# Altium schematic sheet [02] - POWER.SchDoc
size A2; SheetNumber: 5; SheetTotal: 5
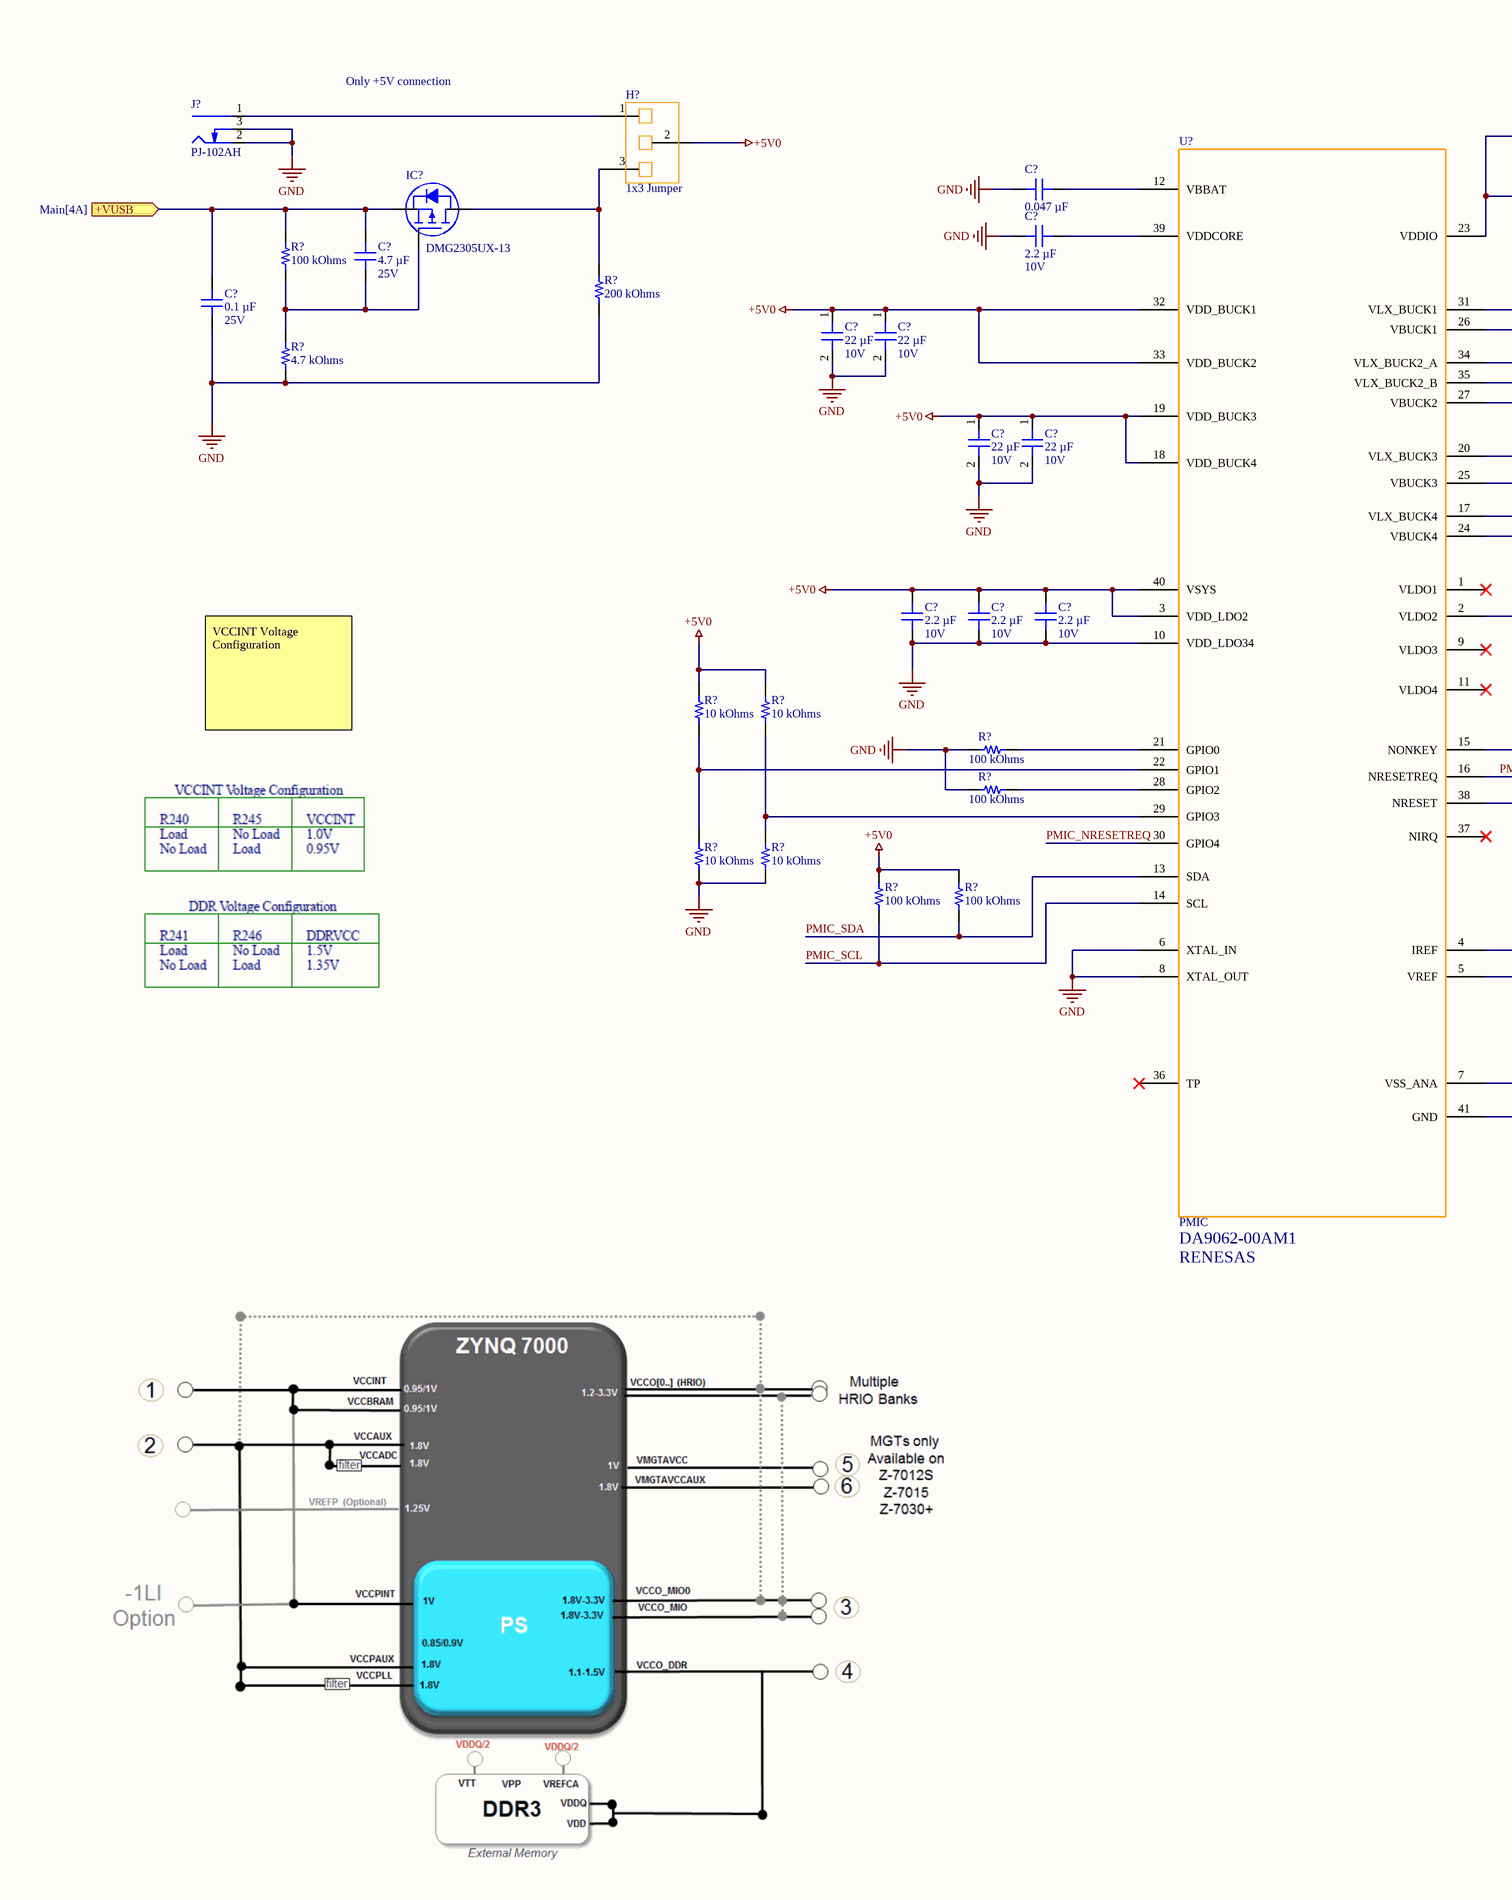
[diagram p0: [02] - POWER.SchDoc, left]
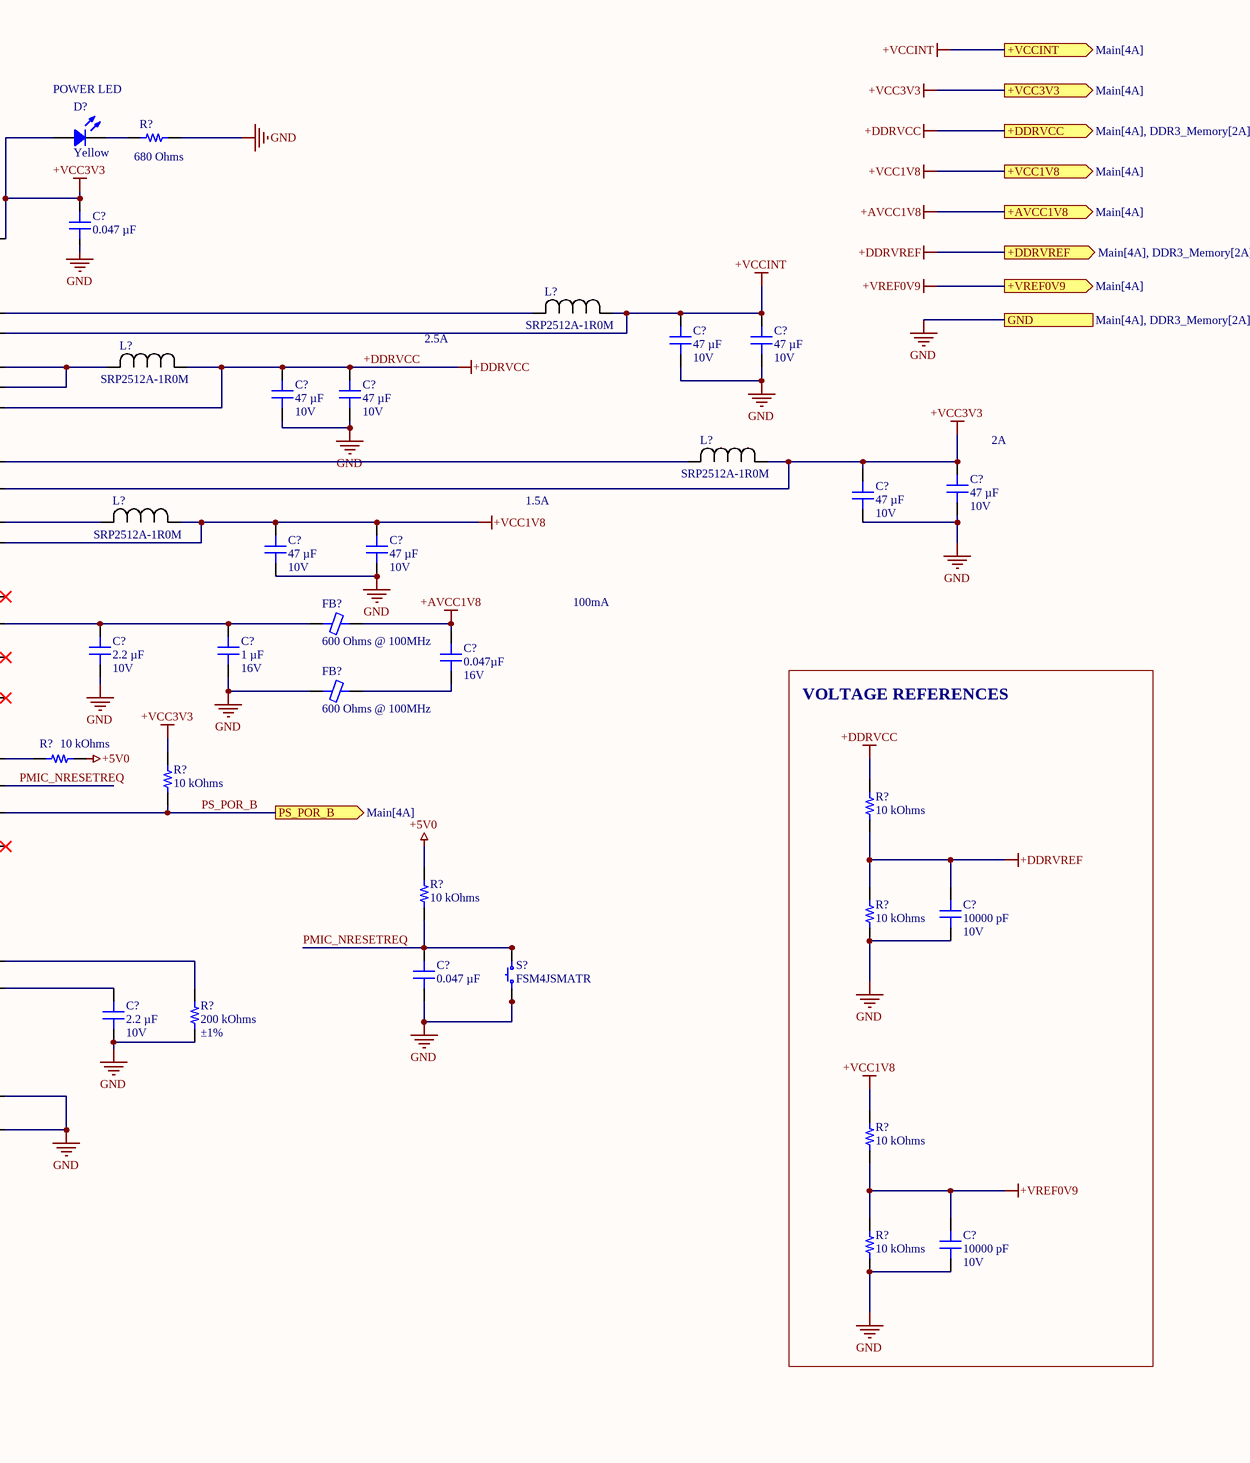
[diagram p1: [02] - POWER.SchDoc, right]

## Parts
(Parts that share a designator on the sheet are numbered #1, #2 ... from top to bottom, then left to right.)
C?#1  0.047 µF  [CAP 0402_1005]
C?#2  0.047 µF  [CAP 0402_1005]
C?#3  Voltage - Rated: 10V  [CAP 0603_1608]  (hidden comment: 2.2 µF)
C?#4  Voltage - Rated: 25V  [CAP 0603_1608]  (hidden comment: 4.7 µF)
C?#5  Voltage - Rated: 25V  [CAP 0402_1005]  (hidden comment: 0.1 µF)
C?#6  Voltage - Rated: 10V  [CAP 0805_2012]  (hidden comment: 22 µF)
C?#7  Voltage - Rated: 10V  [CAP 0805_2012]  (hidden comment: 22 µF)
C?#8  Voltage - Rated: 10V  [CAP 0805_2012]  (hidden comment: 47 µF)
C?#9  Voltage - Rated: 10V  [CAP 0805_2012]  (hidden comment: 47 µF)
C?#10  Voltage - Rated: 10V  [CAP 0805_2012]  (hidden comment: 47 µF)
C?#11  Voltage - Rated: 10V  [CAP 0805_2012]  (hidden comment: 47 µF)
C?#12  Voltage - Rated: 10V  [CAP 0805_2012]  (hidden comment: 22 µF)
C?#13  Voltage - Rated: 10V  [CAP 0805_2012]  (hidden comment: 22 µF)
C?#14  Voltage - Rated: 10V  [CAP 0805_2012]  (hidden comment: 47 µF)
C?#15  Voltage - Rated: 10V  [CAP 0805_2012]  (hidden comment: 47 µF)
C?#16  Voltage - Rated: 10V  [CAP 0805_2012]  (hidden comment: 47 µF)
C?#17  Voltage - Rated: 10V  [CAP 0805_2012]  (hidden comment: 47 µF)
C?#18  Voltage - Rated: 10V  [CAP 0603_1608]  (hidden comment: 2.2 µF)
C?#19  Voltage - Rated: 10V  [CAP 0603_1608]  (hidden comment: 2.2 µF)
C?#20  Voltage - Rated: 10V  [CAP 0603_1608]  (hidden comment: 2.2 µF)
C?#21  Voltage - Rated: 10V  [CAP 0603_1608]  (hidden comment: 2.2 µF)
C?#22  Voltage - Rated: 16V  [CAP 0402_1005]  (hidden comment: 1 µF)
C?#23  Voltage - Rated: 16V  [CAP 0402_1005]  (hidden comment: 0.047µF)
C?#24  Voltage - Rated: 10V  [CAP 0201_0603]  (hidden comment: 10000 pF)
C?#25  0.047 µF  [CAP 0402_1005]
C?#26  Voltage - Rated: 10V  [CAP 0603_1608]  (hidden comment: 2.2 µF)
C?#27  Voltage - Rated: 10V  [CAP 0201_0603]  (hidden comment: 10000 pF)
D?  Yellow  [LED 1206_3216 YELLOW]
FB?#1  600 Ohms @ 100MHz  [FER 0603_1608]
FB?#2  600 Ohms @ 100MHz  [FER 0603_1608]
H?  1x3 Jumper  [1x3 Header]
IC?  DMG2305UX-13  [DIODES SOT-23-3]
J?  PJ-102AH  [CUI PJ-102AH]
L?#1  Manufacturer Part Number: SRP2512A-1R0M  [SRP2512A]  (hidden comment: Inductor)
L?#2  Manufacturer Part Number: SRP2512A-1R0M  [SRP2512A]  (hidden comment: Inductor)
L?#3  Manufacturer Part Number: SRP2512A-1R0M  [SRP2512A]  (hidden comment: Inductor)
L?#4  Manufacturer Part Number: SRP2512A-1R0M  [SRP2512A]  (hidden comment: Inductor)
R?#1  680 Ohms  [RES 0402_1005]
R?#2  100 kOhms  [RES 0402_1005]
R?#3  200 kOhms  [RES 0402_1005]
R?#4  4.7 kOhms  [RES 0402_1005]
R?#5  10 kOhms  [RES 0402_1005]
R?#6  10 kOhms  [RES 0402_1005]
R?#7  100 kOhms  [RES 0402_1005]
R?#8  10 kOhms  [RES 0402_1005]
R?#9  10 kOhms  [RES 0402_1005]
R?#10  100 kOhms  [RES 0402_1005]
R?#11  10 kOhms  [RES 0402_1005]
R?#12  10 kOhms  [RES 0402_1005]
R?#13  10 kOhms  [RES 0402_1005]
R?#14  10 kOhms  [RES 0402_1005]
R?#15  100 kOhms  [RES 0402_1005]
R?#16  100 kOhms  [RES 0402_1005]
R?#17  10 kOhms  [RES 0402_1005]
R?#18  Tolerance: ±1%  [RES 0402_1005]  (hidden comment: 200 kOhms)
R?#19  10 kOhms  [RES 0402_1005]
R?#20  10 kOhms  [RES 0402_1005]
S?  FSM4JSMATR  [TE FSM4JSMA]
U?  PMIC  Manufacturer Part Number: DA9062-00AM1  Manufacturer: RENESAS  [DA9062]

## Blocks framed on the sheet
VOLTAGE REFERENCES: C?#24 C?#27 R?#11 R?#17 R?#19 R?#20

## Ports
+AVCC1V8 (out, see Main[4A]), +DDRVCC (out, see Main[4A], DDR3_Memory[2A]), +DDRVREF (out, see Main[4A], DDR3_Memory[2A]), +VCC1V8 (out, see Main[4A]), +VCC3V3 (out, see Main[4A]), +VCCINT (out, see Main[4A]), +VREF0V9 (out, see Main[4A]), +VUSB (in, see Main[4A]), GND (see Main[4A], DDR3_Memory[2A], FPGA_Power[1A]), PS_POR_B (out, see Main[4A])

## Nets
+5V0: C?#6.1 C?#7.1 C?#12.1 C?#13.1 C?#18.2 C?#19.2 C?#20.2 H?.2 R?#5.2 R?#6.2 R?#8.1 R?#14.2 R?#15.1 R?#16.2 U?.3(VDD_LDO2) U?.18(VDD_BUCK4) U?.19(VDD_BUCK3) U?.32(VDD_BUCK1) U?.33(VDD_BUCK2) U?.40(VSYS)
+AVCC1V8: C?#23.2 FB?#1.2 ; port +AVCC1V8
+DDRVCC: C?#10.2 C?#11.2 L?#2.1 R?#11.2 U?.27(VBUCK2) ; port +DDRVCC
+DDRVREF: C?#24.2 R?#11.1 R?#17.2 ; port +DDRVREF
+VCC1V8: C?#16.2 C?#17.2 L?#4.1 R?#19.2 U?.24(VBUCK4) ; port +VCC1V8
+VCC3V3: C?#2.2 C?#14.2 C?#15.2 D?.1 L?#3.1 R?#9.2 U?.23(VDDIO) U?.25(VBUCK3) ; port +VCC3V3
+VCCINT: C?#8.2 C?#9.2 L?#1.1 U?.26(VBUCK1) ; port +VCCINT
+VREF0V9: C?#27.2 R?#19.1 R?#20.2 ; port +VREF0V9
GND: C?#1.1 C?#2.1 C?#3.2 C?#5.1 C?#6.2 C?#7.2 C?#8.1 C?#9.1 C?#10.1 C?#11.1 C?#12.2 C?#13.2 C?#14.1 C?#15.1 C?#16.1 C?#17.1 C?#18.1 C?#19.1 C?#20.1 C?#21.1 C?#22.1 C?#24.1 C?#25.1 C?#26.1 C?#27.1 FB?#2.1 J?.2(Outer) J?.3(SW) R?#1.2 R?#3.1 R?#4.1 R?#7.1 R?#10.1 R?#12.1 R?#13.1 R?#17.1 R?#18.1 R?#20.1 S?.1 S?.2 U?.6(XTAL_IN) U?.7(VSS_ANA) U?.8(XTAL_OUT) U?.10(VDD_LDO34) U?.41(GND) ; port GND
+VUSB: C?#4.2 C?#5.2 IC?.2(S) R?#2.2 ; port +VUSB
PMIC_NRESETREQ: C?#25.2 R?#14.1 S?.3 S?.4 U?.16(NRESETREQ) U?.30(GPIO4)
PMIC_SCL: R?#15.2 U?.14(SCL)
PMIC_SDA: R?#16.1 U?.13(SDA)
PS_POR_B: R?#9.1 U?.38(NRESET) ; port PS_POR_B
NetC?#1_2: C?#1.2 U?.12(VBBAT)
NetC?#3_1: C?#3.1 U?.39(VDDCORE)
NetC?#4_1: C?#4.1 IC?.1(G) R?#2.1 R?#4.2
NetC?#21_2: C?#21.2 C?#22.2 FB?#1.1 U?.2(VLDO2)
NetC?#23_1: C?#23.1 FB?#2.2
NetC?#26_2: C?#26.2 U?.5(VREF)
NetD?_2: D?.2 R?#1.1
NetH?_1: H?.1 J?.1(Centre)
NetH?_3: H?.3 IC?.3(D) R?#3.2
NetL?#1_2: L?#1.2 U?.31(VLX_BUCK1)
NetL?#2_2: L?#2.2 U?.34(VLX_BUCK2_A) U?.35(VLX_BUCK2_B)
NetL?#3_2: L?#3.2 U?.20(VLX_BUCK3)
NetL?#4_2: L?#4.2 U?.17(VLX_BUCK4)
NetR?#5_1: R?#5.1 R?#12.2 U?.22(GPIO1)
NetR?#6_1: R?#6.1 R?#13.2 U?.29(GPIO3)
NetR?#7_2: R?#7.2 U?.21(GPIO0)
NetR?#8_2: R?#8.2 U?.15(NONKEY)
NetR?#10_2: R?#10.2 U?.28(GPIO2)
NetR?#18_2: R?#18.2 U?.4(IREF)

Not connected (* = marked no-connect by the designer): U? 1(VLDO1)* 9(VLDO3)* 11(VLDO4)* 36(TP)* 37(NIRQ)*

## Notes on the sheet
- Only +5V connection
- POWER LED
- 2.5A
- (near C?#14) 2A
- 1.5A
- 100mA
- VCCINT Voltage Configuration

## Library data of the parts
C?#1 C?#2 C?#25 = MSAST105SB7473MFNA01: CAP CER 0.047UF 25V X7R 0402; manufacturer: Taiyo Yuden; Tolerance: ±20%; Part Number: MSAST105SB7473MFNA01; Value: 0.047 µF; Applications: General Purpose; Capacitance: 0.047 µF; componentlink2description: DigiKey Link; componentlink2url: https://www.digikey.com/en/products/detail/taiyo-yuden/MSAST105SB7473MFNA01/16667723; Device Package: 0402 (1005 Metric); lastupdated: 24.04.2023 19:04:05; Lifecycle Status: Active; Minimum Order: 1; Mounting Type: Surface Mount, MLCC; Operating Temperature: -55°C ~ 125°C; Package / Case: 0402 (1005 Metric); packaging: CutTape; partid: 47075; Part Status: Active; price: 0.01; series: MSAS; Size / Dimension: 0.039" L x 0.020" W (1.00mm x 0.50mm); Supplier 1: DigiKey; Supplier Part Number 1: 587-MSAST105SB7473MFNA01CT-ND; Temperature Coefficient: X7R; Thickness (Max): 0.022" (0.55mm); Voltage - Rated: 25V
C?#3 C?#18-C?#21 C?#26 = CC0603ZRY5V6BB225: CAP CER 2.2UF 10V Y5V 0603; manufacturer: Yageo; Temperature Coefficient: Y5V (F); Tolerance: -20%, +80%; Part Number: CC0603ZRY5V6BB225; Value: 2.2 µF; Applications: General Purpose; Capacitance: 2.2 µF; componentlink1description: Datasheet; componentlink1url: http://www.yageo.com/documents/recent/UPY-GPHC_Y5V_6.3V-to-50V_8.pdf; componentlink2description: DigiKey Link; componentlink2url: https://www.digikey.com/en/products/detail/yageo/CC0603ZRY5V6BB225/2833615; Device Package: 0603 (1608 Metric); lastupdated: 24.04.2023 19:09:27; Lifecycle Status: Active; Minimum Order: 1; Mounting Type: Surface Mount, MLCC; Operating Temperature: -30°C ~ 85°C; Package / Case: 0603 (1608 Metric); packaging: TapeAndReel; partid: 2248; Part Status: Active; price: 0.01; series: CC; Size / Dimension: 0.063" L x 0.031" W (1.60mm x 0.80mm); Supplier 1: DigiKey; Supplier Part Number 1: 311-1450-1-ND; Thickness (Max): 0.035" (0.90mm)
C?#4 = CL10A475KA8NQNC: CAP CER 4.7UF 25V X5R 0603; manufacturer: Samsung Electro-Mechanics; Tolerance: ±10%; Part Number: CL10A475KA8NQNC; Value: 4.7 µF; Applications: General Purpose; Capacitance: 4.7 µF; componentlink1description: Datasheet; componentlink1url: http://www.samsungsem.com/kr/support/product-search/mlcc/CL10A475KA8NQNC.jsp; componentlink2description: DigiKey Link; componentlink2url: https://www.digikey.com/en/products/detail/samsung-electro-mechanics/CL10A475KA8NQNC/3887558; Device Package: 0603 (1608 Metric); lastupdated: 25.04.2023 19:09:30; Lifecycle Status: Active; Minimum Order: 1; Mounting Type: Surface Mount, MLCC; Operating Temperature: -55°C ~ 85°C; Package / Case: 0603 (1608 Metric); packaging: TapeAndReel; partid: 2349; Part Status: Active; price: 0.06; series: CL; Size / Dimension: 0.063" L x 0.031" W (1.60mm x 0.80mm); Supplier 1: DigiKey; Supplier Part Number 1: 1276-1900-1-ND; Temperature Coefficient: X5R; Thickness (Max): 0.035" (0.90mm)
C?#5 = 04023C104KAT2A-62: 0402 25V X7R 100 NF 10%; manufacturer: KYOCERA AVX; Part Number: 04023C104KAT2A-62; Value: 0.1 µF; Applications: General Purpose; Capacitance: 0.1 µF; componentlink1description: Datasheet; componentlink1url: https://datasheets.kyocera-avx.com/X7RDielectric.pdf; componentlink2description: DigiKey Link; componentlink2url: https://www.digikey.com/en/products/detail/kyocera-avx/04023C104KAT2A-62/17868566; Device Package: 0402 (1005 Metric); lastupdated: 25.04.2023 19:03:40; Lifecycle Status: Active; Minimum Order: 1; Mounting Type: Surface Mount, MLCC; Operating Temperature: -55°C ~ 125°C; Package / Case: 0402 (1005 Metric); packaging: TapeAndReel; partid: 48205; Part Status: Active; price: 0.07; series: -; Size / Dimension: 0.039" L x 0.020" W (1.00mm x 0.50mm); Supplier 1: DigiKey; Supplier Part Number 1: 478-04023C104KAT2A-62CT-ND; Temperature Coefficient: X7R; Thickness (Max): 0.022" (0.56mm); Tolerance: ±10%
C?#6 C?#7 C?#12 C?#13 = LMK212BJ226MG-T: CAP CER 22UF 10V X5R 0805; manufacturer: Taiyo Yuden; Tolerance: ±20%; Part Number: LMK212BJ226MG-T; Value: 22 µF; Applications: SMPS Filtering; Capacitance: 22 µF; componentlink1description: Datasheet; componentlink1url: https://www.yuden.co.jp/productdata/catalog/mlcc01_e.pdf; componentlink2description: DigiKey Link; componentlink2url: https://www.digikey.com/en/products/detail/taiyo-yuden/LMK212BJ226MG-T/1646587; Device Package: 0805 (2012 Metric); lastupdated: 24.04.2023 19:13:05; Lifecycle Status: Active; Minimum Order: 1; Mounting Type: Surface Mount, MLCC; Operating Temperature: -55°C ~ 85°C; Package / Case: 0805 (2012 Metric); packaging: TapeAndReel; partid: 3025; Part Status: Active; price: 0.06; series: M; Size / Dimension: 0.079" L x 0.049" W (2.00mm x 1.25mm); Supplier 1: DigiKey; Supplier Part Number 1: 587-1958-1-ND; Temperature Coefficient: X5R; Thickness (Max): 0.053" (1.35mm)
C?#8-C?#11 C?#14-C?#17 = GRM21BR61A476ME15L: CAP CER 47UF 10V X5R 0805; manufacturer: Murata Electronics; Tolerance: ±20%; Part Number: GRM21BR61A476ME15L; Value: 47 µF; Applications: General Purpose; Capacitance: 47 µF; componentlink1description: Datasheet; componentlink1url: https://search.murata.co.jp/Ceramy/image/img/A01X/G101/ENG/GRM21BR61A476ME15-01.pdf; componentlink2description: DigiKey Link; componentlink2url: https://www.digikey.com/en/products/detail/murata-electronics/GRM21BR61A476ME15L/4905529; Device Package: 0805 (2012 Metric); lastupdated: 24.04.2023 19:13:01; Lifecycle Status: Active; Minimum Order: 1; Mounting Type: Surface Mount, MLCC; Operating Temperature: -55°C ~ 85°C; Package / Case: 0805 (2012 Metric); packaging: TapeAndReel; partid: 40304; Part Status: Active; price: 0.16; series: GRM; Size / Dimension: 0.079" L x 0.049" W (2.00mm x 1.25mm); Supplier 1: DigiKey; Supplier Part Number 1: 490-9961-1-ND; Temperature Coefficient: X5R; Thickness (Max): 0.057" (1.45mm)
C?#22 = GMC04X5R105K16NT: CAP0402 X5R 1UF 10% 16V; manufacturer: Cal-Chip Electronics, Inc.; Part Number: GMC04X5R105K16NT; Value: 1 µF; Applications: General Purpose; Capacitance: 1 µF; componentlink1description: Datasheet; componentlink1url: https://88ce57.p3cdn1.secureserver.net/wp-content/uploads/2023/01/gmc_series-2.pdf; componentlink2description: DigiKey Link; componentlink2url: https://www.digikey.com/en/products/detail/cal-chip-electronics-inc/GMC04X5R105K16NT/18151143; Device Package: 0402 (1005 Metric); lastupdated: 24.04.2023 19:03:50; Lifecycle Status: Active; Minimum Order: 1; Mounting Type: Surface Mount, MLCC; Operating Temperature: -55°C ~ 85°C; Package / Case: 0402 (1005 Metric); packaging: TapeAndReel; partid: 49824; Part Status: Active; price: 0.01; series: GMC; Size / Dimension: 0.039" L x 0.020" W (1.00mm x 0.50mm); Supplier 1: DigiKey; Supplier Part Number 1: 4713-GMC04X5R105K16NTCT-ND; Temperature Coefficient: X5R; Thickness (Max): 0.022" (0.55mm); Tolerance: ±10%
C?#23 = 0402YD473KAT2A: CAP CER 0.047UF 16V X5R 0402; manufacturer: AVX Corporation; Tolerance: ±10%; Part Number: 0402YD473KAT2A; Value: 0.047µF; Applications: General Purpose; Capacitance: 0.047µF; componentlink1description: Datasheet; componentlink1url: http://datasheets.avx.com/cx5r.pdf; componentlink2description: DigiKey Link; componentlink2url: http://digikey.com/product-detail/en/avx-corporation/0402YD473KAT2A/478-1125-1-ND/564157; Device Package: 0402 (1005 Metric); lastupdated: 8.02.2022 12:26:58; Lifecycle Status: Active; Minimum Order: 1; Mounting Type: Surface Mount, MLCC; Operating Temperature: -55°C ~ 85°C; Package / Case: 0402 (1005 Metric); packaging: TapeAndReel; partid: 1776; Part Status: Active; price: 0.02; series: -; Size / Dimension: 0.039" L x 0.020" W (1.00mm x 0.50mm); Supplier 1: DigiKey; Supplier Part Number 1: 478-1125-1-ND; Temperature Coefficient: X5R; Thickness (Max): 0.022" (0.56mm)
C?#24 C?#27 = MAASL063SB7103MFCA01: CAP CER 0.01UF 10V X7R 0201; manufacturer: Taiyo Yuden; Tolerance: ±20%; Part Number: MAASL063SB7103MFCA01; Value: 10000 pF; Applications: Automotive; Capacitance: 10000 pF; componentlink1description: Datasheet; componentlink1url: https://media.digikey.com/pdf/Data%20Sheets/Taiyo%20Yuden%20PDFs%20URL%20links/MAASL063SB7103MFCA01_SS.pdf; componentlink2description: DigiKey Link; componentlink2url: https://www.digikey.com/en/products/detail/taiyo-yuden/MAASL063SB7103MFCA01/18109005; Device Package: 0201 (0603 Metric); Height - Seated (Max): 0.013" (0.33mm); lastupdated: 27.04.2023 19:00:59; Lifecycle Status: Active; Minimum Order: 1; Mounting Type: Surface Mount, MLCC; Operating Temperature: -55°C ~ 125°C; Package / Case: 0201 (0603 Metric); packaging: TapeAndReel; partid: 47946; Part Status: Active; price: 0.01; Ratings: AEC-Q200; series: MAAS; Size / Dimension: 0.024" L x 0.012" W (0.60mm x 0.30mm); Supplier 1: DigiKey; Supplier Part Number 1: 587-MAASL063SB7103MFCA01CT-ND; Temperature Coefficient: X7R; Thickness (Max): 0.013" (0.33mm)
D? = 5990240007F: LED YELLOW 1206 SMD; Manufacturer: Dialight; Configuration: Standard; Current - Test: 20mA; Lens Color: 0.80mm; Lens Size: 2.00mm x 1.60mm; Lens Style: Rectangle with Flat Top; Millicandela Rating: 126mcd; Viewing Angle: 140°; Voltage - Forward (Vf) (Typ): 2.1V; Wavelength - Dominant: 590nm; Part Number: 5990240007F; Color: Yellow; ComponentLink1Description: Datasheet; ComponentLink1URL: http://www.dialightsignalsandcomponents.com/Assets/Brochures_And_Catalogs/Indication/CBI_SMD_new/Dialight_CBI_data_599-1206_Apr2018.pdf; ComponentLink2Description: DigiKey Link; ComponentLink2URL: https://www.digikey.com/en/products/detail/dialight/5990240007F/9385418; Device Package: 1206 (3216 Metric); Height (Max): 0.80mm; LastUpdated: 24.04.2023 20:07:19; Lifecycle Status: Active; Minimum Order: 1; Mounting Type: Surface Mount; Package / Case: 1206 (3216 Metric); Packaging: TapeAndReel; PartId: 1; Part Status: Active; Price: 0.04; Series: 599; Size / Dimension: 3.20mm L x 1.60mm W; Supplier 1: DigiKey; Supplier Part Number 1: 350-4363-1-ND; Supplier Device Package: 1206; Value: Yellow
FB?#1 FB?#2 = BLM18DN601SZ1D: FERRITEBEAD SMD Z100MHZ=600OHM 7; Manufacturer: Murata Electronics; Current Rating (Max): 700mA; Number of Lines: 1; Part Number: BLM18DN601SZ1D; ComponentLink1Description: Datasheet; ComponentLink1URL: https://www.murata.com/en-us/api/pdfdownloadapi?cate=luNoiseSupprFilteChipFerriBead&partno=BLM18DN601SZ1%23; ComponentLink2Description: DigiKey Link; ComponentLink2URL: http://digikey.com/product-detail/en/murata-electronics/BLM18DN601SZ1D/490-18575-1-ND/10135586; Device Package: 0603 (1608 Metric); Height (Max): 0.037" (0.95mm); Impedance @ Frequency: 600 Ohms @ 100MHz; LastUpdated: 2.09.2020 01:18:18; Lifecycle Status: Active; Minimum Order: 1; Mounting Type: Surface Mount; Operating Temperature: -55°C ~ 125°C; Package / Case: 0603 (1608 Metric); Packaging: TapeAndReel; PartId: 783; Part Status: Active; Price: 0.05; Ratings: AEC-Q200; Series: EMIFIL®, BLM18; Size / Dimension: 0.063" L x 0.031" W (1.60mm x 0.80mm); Supplier 1: DigiKey; Supplier Part Number 1: 490-18575-1-ND; Value: 600 Ohms @ 100MHz
IC? = DMG2305UX-13: MOSFET P-CH 20V 4.2A SOT23; Manufacturer: Diodes Incorporated; Current - Continuous Drain (Id) @ 25°C: 4.2A (Ta); Drive Voltage (Max Rds On,  Min Rds On): 1.8V, 4.5V; FET Type: P-Channel; Gate Charge (Qg) (Max) @ Vgs: 10.2 nC @ 4.5 V; Input Capacitance (Ciss) (Max) @ Vds: 808 pF @ 15 V; Power Dissipation (Max): 1.4W (Ta); Rds On (Max) @ Id, Vgs: 52mOhm @ 4.2A, 4.5V; Vgs (Max): ±8V; Vgs(th) (Max) @ Id: 900mV @ 250µA; Part Number: DMG2305UX-13; ComponentLink1Description: Datasheet; ComponentLink1URL: https://www.diodes.com/assets/Datasheets/DMG2305UX.pdf; ComponentLink2Description: DigiKey Link; ComponentLink2URL: https://www.digikey.com/en/products/detail/diodes-incorporated/DMG2305UX-13/4251560; Drain to Source Voltage (Vdss): 20 V; LastUpdated: 25.04.2023 20:07:38; Lifecycle Status: Active; Minimum Order: 1; Mounting Type: Surface Mount; Operating Temperature: -55°C ~ 150°C (TJ); Package / Case: TO-236-3, SC-59, SOT-23-3; Packaging: TapeAndReel; Part Status: Active; Price: 0.04; Series: -; Supplier 1: DigiKey; Supplier Part Number 1: DMG2305UX-13DICT-ND; Supplier Device Package: SOT-23-3; Technology: MOSFET (Metal Oxide)
J? = PJ-102AH: CONN PWR JACK 2X5.5MM SOLDER; Manufacturer: CUI Devices; Actual Diameter: 0.079" (2.00mm ID), 0.256" (6.50mm OD); Current Rating (Amps): 5A; Gender: Male; Industry Recognized Mating Diameter: 2.00mm ID (0.079"), 5.50mm OD (0.217"); Internal Switch(s): Single Switch, Normally Closed; Material Flammability Rating: UL94 V-0; Mating Length/Depth: 0.354" (9.00mm); Number of Positions/Contacts: 2 Conductors, 3 Contacts; Shielding: Unshielded; Voltage - Rated: 24VDC; Part Number: PJ-102AH; ComponentLink1Description: Datasheet; ComponentLink1URL: https://www.cuidevices.com/product/resource/digikeypdf/pj-102ah.pdf; ComponentLink2Description: DigiKey Link; ComponentLink2URL: //digikey.com/product-detail/en/cui-devices/PJ-102AH/CP-102AH-ND/408448; Connector Type: Jack; LastUpdated: 16.12.2019 19:01:27; Lifecycle Status: 0; Minimum Order: 1; Mounting Type: Through Hole, Right Angle; Packaging: Tray; Part Status: Active; Price: 0.76; Series: -; Supplier 1: DigiKey; Supplier Part Number 1: CP-102AH-ND; Termination: Solder
L?#1-L?#4 = SRP2512A: FIXED IND 1UH 3.5A 49 MOHM SMD; Manufacturer: Bourns
R?#1 = ERJ-2RKF6800X: RES SMD 680 OHM 1% 1/10W 0402; Manufacturer: Panasonic Electronic Components; Power (Watts): 0.1W, 1/10W; Temperature Coefficient: ±100ppm/°C; Part Number: ERJ-2RKF6800X; Value: 680 Ohms; ComponentLink1Description: Datasheet; ComponentLink1URL: https://industrial.panasonic.com/cdbs/www-data/pdf/RDA0000/AOA0000C304.pdf; ComponentLink2Description: DigiKey Link; ComponentLink2URL: https://www.digikey.com/en/products/detail/panasonic-electronic-components/ERJ-2RKF6800X/1746268; Composition: Thick Film; Device Package: 0402 (1005 Metric); Features: Automotive AEC-Q200; Height - Seated (Max): 0.016" (0.40mm); LastUpdated: 24.04.2023 19:23:28; Lifecycle Status: Active; Minimum Order: 1; Number of Terminations: 2; Operating Temperature: -55°C ~ 155°C; Package / Case: 0402 (1005 Metric); Packaging: CutTape; PartId: 21210; Part Status: Active; Price: 0.01; Ratings: AEC-Q200; Resistance: 680 Ohms; Series: ERJ-2RK; Size / Dimension: 0.039" L x 0.020" W (1.00mm x 0.50mm); Supplier 1: DigiKey; Supplier Part Number 1: P680LCT-ND; Supplier Device Package: 0402; Tolerance: ±1%
R?#2 = RCS0402100KJNED: RES SMD 100K OHM 5% 1/5W 0402; Manufacturer: Vishay Dale; Power (Watts): 0.2W, 1/5W; Temperature Coefficient: ±200ppm/°C; Part Number: RCS0402100KJNED; Value: 100 kOhms; ComponentLink1Description: Datasheet; ComponentLink1URL: http://www.vishay.com/docs/20065/rcse3.pdf; ComponentLink2Description: DigiKey Link; ComponentLink2URL: https://www.digikey.com/en/products/detail/vishay-dale/RCS0402100KJNED/5867065; Composition: Thick Film; Device Package: 0402 (1005 Metric); Features: Automotive AEC-Q200, Pulse Withstanding; Height - Seated (Max): 0.016" (0.40mm); LastUpdated: 25.04.2023 19:20:06; Lifecycle Status: Active; Minimum Order: 1; Number of Terminations: 2; Operating Temperature: -55°C ~ 155°C; Package / Case: 0402 (1005 Metric); Packaging: TapeAndReel; PartId: 5535; Part Status: Active; Price: 0.01; Ratings: AEC-Q200; Resistance: 100 kOhms; Series: RCS e3; Size / Dimension: 0.039" L x 0.020" W (1.00mm x 0.50mm); Supplier 1: DigiKey; Supplier Part Number 1: 541-2919-1-ND; Supplier Device Package: 0402; Tolerance: ±5%
R?#3 = RC0402JR-07200KL: RES 200K OHM 5% 1/16W 0402; Manufacturer: Yageo; Power (Watts): 0.063W, 1/16W; Temperature Coefficient: ±100ppm/°C; Part Number: RC0402JR-07200KL; Value: 200 kOhms; ComponentLink1Description: Datasheet; ComponentLink1URL: https://www.yageo.com/upload/media/product/productsearch/datasheet/rchip/PYu-RC_Group_51_RoHS_L_10.pdf; ComponentLink2Description: DigiKey Link; ComponentLink2URL: https://www.digikey.com/en/products/detail/yageo/RC0402JR-07200KL/726440; Composition: Thick Film; Device Package: 0402 (1005 Metric); Features: Moisture Resistant; Height - Seated (Max): 0.016" (0.40mm); LastUpdated: 25.04.2023 19:20:07; Lifecycle Status: Active; Minimum Order: 1; Number of Terminations: 2; Operating Temperature: -55°C ~ 155°C; Package / Case: 0402 (1005 Metric); Packaging: CutTape; PartId: 4825; Part Status: Active; Price: 0.01; Resistance: 200 kOhms; Series: RC_L; Size / Dimension: 0.039" L x 0.020" W (1.00mm x 0.50mm); Supplier 1: DigiKey; Supplier Part Number 1: 311-200KJRCT-ND; Supplier Device Package: 0402; Tolerance: ±5%
R?#4 = RC0402JR-074K7P: RES SMD 4.7K OHM 5% 1/16W 0402; Manufacturer: Yageo; Power (Watts): 0.063W, 1/16W; Temperature Coefficient: ±100ppm/°C; Part Number: RC0402JR-074K7P; Value: 4.7 kOhms; ComponentLink1Description: Datasheet; ComponentLink1URL: http://www.yageo.com/NewPortal/yageodocoutput?fileName=/pdf/R-Chip/PYu-RC_51_RoHS_P_0.pdf; ComponentLink2Description: DigiKey Link; ComponentLink2URL: https://www.digikey.com/en/products/detail/yageo/RC0402JR-074K7P/4935302; Composition: Thick Film; Device Package: 0402 (1005 Metric); Features: Moisture Resistant; Height - Seated (Max): 0.016" (0.40mm); LastUpdated: 25.04.2023 19:20:06; Lifecycle Status: Active; Minimum Order: 1; Number of Terminations: 2; Operating Temperature: -55°C ~ 155°C; Package / Case: 0402 (1005 Metric); Packaging: CutTape; PartId: 5281; Part Status: Active; Price: 0.01; Resistance: 4.7 kOhms; Series: RC-P Lead Free; Size / Dimension: 0.039" L x 0.020" W (1.00mm x 0.50mm); Supplier 1: DigiKey; Supplier Part Number 1: YAG1287CT-ND; Supplier Device Package: 0402; Tolerance: ±5%
R?#5 R?#6 R?#8 R?#9 R?#11-R?#14 R?#17 R?#19 R?#20 = CRCW040210K0FKEE: RES SMD 10K OHM 1% 1/16W 0402; Manufacturer: Vishay Dale; Power (Watts): 0.063W, 1/16W; Temperature Coefficient: ±100ppm/°C; Part Number: CRCW040210K0FKEE; Value: 10 kOhms; ComponentLink1Description: Datasheet; ComponentLink1URL: http://www.vishay.com/docs/20035/dcrcwe3.pdf; ComponentLink2Description: DigiKey Link; ComponentLink2URL: https://www.digikey.com/en/products/detail/vishay-dale/CRCW040210K0FKEE/5069897; Composition: Thick Film; Device Package: 0402 (1005 Metric); Features: Automotive AEC-Q200; Height - Seated (Max): 0.016" (0.40mm); LastUpdated: 24.04.2023 19:24:49; Lifecycle Status: Active; Minimum Order: 1; Number of Terminations: 2; Operating Temperature: -55°C ~ 155°C; Package / Case: 0402 (1005 Metric); Packaging: CutTape; PartId: 3471; Part Status: Active; Price: 0.01; Ratings: AEC-Q200; Resistance: 10 kOhms; Series: CRCW; Size / Dimension: 0.039" L x 0.020" W (1.00mm x 0.50mm); Supplier 1: DigiKey; Supplier Part Number 1: 541-2954-1-ND; Supplier Device Package: 0402; Tolerance: ±1%
R?#7 R?#10 R?#15 R?#16 = SR0402FR-7T100KL: RES 100K OHM 1% 1/5W 0402; Manufacturer: Yageo; Power (Watts): 0.2W, 1/5W; Temperature Coefficient: ±100ppm/°C; Part Number: SR0402FR-7T100KL; Value: 100 kOhms; ComponentLink1Description: Datasheet; ComponentLink1URL: http://www.yageo.com/documents/recent/PYu-SR_D_F%20tol_RoHS_L_4.pdf; ComponentLink2Description: DigiKey Link; ComponentLink2URL: https://www.digikey.com/en/products/detail/yageo/SR0402FR-7T100KL/9373087; Composition: Thick Film; Device Package: 0402 (1005 Metric); Features: Automotive AEC-Q200, Pulse Withstanding; Height - Seated (Max): 0.016" (0.40mm); LastUpdated: 24.04.2023 19:24:45; Lifecycle Status: Active; Minimum Order: 1; Number of Terminations: 2; Operating Temperature: -55°C ~ 155°C; Package / Case: 0402 (1005 Metric); Packaging: TapeAndReel; PartId: 4405; Part Status: Active; Price: 0.09; Ratings: AEC-Q200; Resistance: 100 kOhms; Series: SR; Size / Dimension: 0.039" L x 0.020" W (1.00mm x 0.50mm); Supplier 1: DigiKey; Supplier Part Number 1: YAG5813CT-ND; Supplier Device Package: 0402; Tolerance: ±1%
R?#18 = RMCF0402FT200K: RES 200K OHM 1% 1/16W 0402; Manufacturer: Stackpole Electronics Inc; Power (Watts): 0.063W, 1/16W; Temperature Coefficient: ±100ppm/°C; Part Number: RMCF0402FT200K; Value: 200 kOhms; ComponentLink1Description: Datasheet; ComponentLink1URL: https://www.seielect.com/catalog/sei-rmcf_rmcp.pdf; ComponentLink2Description: DigiKey Link; ComponentLink2URL: https://www.digikey.com/en/products/detail/stackpole-electronics-inc/RMCF0402FT200K/1714538; Composition: Thick Film; Device Package: 0402 (1005 Metric); Features: Automotive AEC-Q200; Height - Seated (Max): 0.016" (0.40mm); LastUpdated: 24.04.2023 19:24:41; Lifecycle Status: Active; Minimum Order: 1; Number of Terminations: 2; Operating Temperature: -55°C ~ 155°C; Package / Case: 0402 (1005 Metric); Packaging: CutTape; PartId: 5001; Part Status: Active; Price: 0.01; Ratings: AEC-Q200; Resistance: 200 kOhms; Series: RMCF; Size / Dimension: 0.039" L x 0.020" W (1.00mm x 0.50mm); Supplier 1: DigiKey; Supplier Part Number 1: RMCF0402FT200KCT-ND; Supplier Device Package: 0402
S? = FSM4JSMATR: SWITCH TACTILE SPST-NO 0.05A 24V; Manufacturer: TE Connectivity ALCOSWITCH Switches; Actuator Height off PCB, Vertical: 5.00mm; Actuator Orientation: Top Actuated; Actuator Type: Standard; Contact Rating @ Voltage: 0.05A @ 24VDC; Illumination: Non-Illuminated; Operating Force: 160gf; Outline: 6.00mm x 6.00mm; Switch Function: Off-Mom; Part Number: FSM4JSMATR; Circuit: SPST-NO; ComponentLink1Description: Datasheet; ComponentLink1URL: https://www.te.com/commerce/DocumentDelivery/DDEController?Action=srchrtrv&DocNm=1308111-1_SWITCHES_CORE_PROGRAM_CATALOG&DocType=CS&DocLang=English; ComponentLink2Description: DigiKey Link; ComponentLink2URL: https://www.digikey.com/en/products/detail/te-connectivity-alcoswitch-switches/FSM4JSMATR/529675; LastUpdated: 24.04.2023 20:19:58; Lifecycle Status: Active; Minimum Order: 1; Mounting Type: Surface Mount; Operating Temperature: -35°C ~ 85°C; Packaging: TapeAndReel; Part Status: Active; Price: 0.17; Series: FSMJSMA; Supplier 1: DigiKey; Supplier Part Number 1: 450-1759-1-ND; Termination Style: Gull Wing
U? = DA9062: Designed for Applications Requiring up to 8.5 A